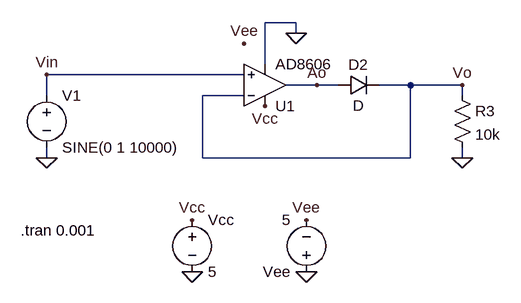
[diagram p0: schematic SuperDiodeHalfWaveRectifier.asc]
SuperDiodeHalfWaveRectifier.asc, the LTspice schematic file:
Version 4
SHEET 1 880 680
WIRE 256 48 208 48
WIRE 256 64 256 48
WIRE 208 112 208 48
WIRE 176 128 -128 128
WIRE 288 144 240 144
WIRE 320 144 288 144
WIRE 432 144 384 144
WIRE 512 144 432 144
WIRE -128 160 -128 128
WIRE 176 160 112 160
WIRE 512 160 512 144
WIRE -128 256 -128 240
WIRE 112 256 112 160
WIRE 432 256 432 144
WIRE 432 256 112 256
WIRE 512 256 512 240
FLAG 96 432 0
FLAG 272 432 0
FLAG 176 80 Vee
FLAG 208 176 Vcc
FLAG -128 256 0
FLAG 512 256 0
FLAG 512 144 Vo
FLAG -128 128 Vin
FLAG 96 352 Vcc
FLAG 272 352 Vee
FLAG 288 144 Ao
FLAG 256 64 0
SYMBOL voltage 96 336 R0
WINDOW 123 0 0 Left 0
WINDOW 39 0 0 Left 0
SYMATTR InstName Vcc
SYMATTR Value 5
SYMBOL voltage 272 448 R180
WINDOW 123 0 0 Left 0
WINDOW 39 0 0 Left 0
SYMATTR InstName Vee
SYMATTR Value 5
SYMBOL voltage -128 144 R0
WINDOW 123 0 0 Left 0
WINDOW 39 0 0 Left 0
SYMATTR InstName V1
SYMATTR Value SINE(0 1 10000)
SYMBOL res 496 144 R0
SYMATTR InstName R3
SYMATTR Value 10k
SYMBOL diode 320 160 R270
WINDOW 0 32 32 VTop 2
WINDOW 3 0 32 VBottom 2
SYMATTR InstName D2
SYMBOL OpAmps\\AD8606 208 208 M180
SYMATTR InstName U1
TEXT -168 368 Left 2 !.tran 0.001

The netlist it stands for:
* SuperDiodeHalfWaveRectifier.asc
Vcc Vcc 0 5
Vee 0 Vee 5
V1 Vin 0 SINE(0 1 10000)
R3 Vo 0 10k
D2 Ao Vo D
XU1 Vin Vo Vcc 0 Ao AD8606  ; pins In+ In- V+ V- OUT
.model D D
.lib standard.dio
.tran 0.001
.lib ADI.lib
.backanno
.end